# Altium schematic sheet control2.SchDoc
size A4
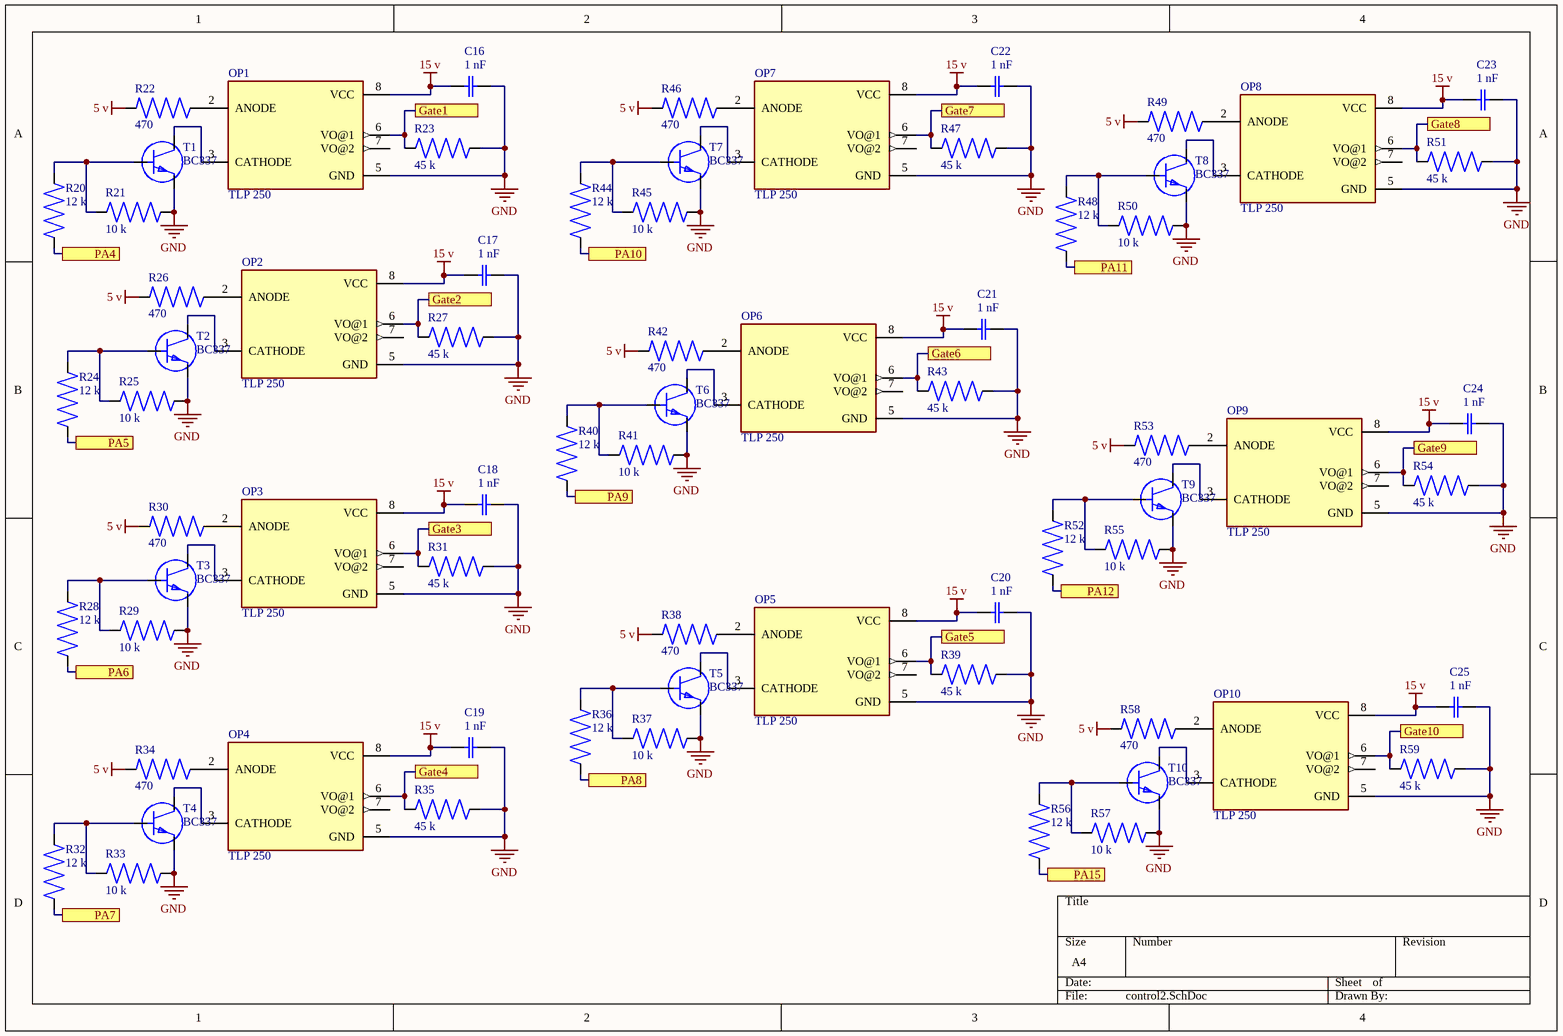
[diagram p0: control2.SchDoc]

## Parts
C16  1 nF  [0805-c]
C17  1 nF  [0805-c]
C18  1 nF  [0805-c]
C19  1 nF  [0805-c]
C20  1 nF  [0805-c]
C21  1 nF  [0805-c]
C22  1 nF  [0805-c]
C23  1 nF  [0805-c]
C24  1 nF  [0805-c]
C25  1 nF  [0805-c]
OP1  TLP 250  [TLP 250]
OP2  TLP 250  [TLP 250]
OP3  TLP 250  [TLP 250]
OP4  TLP 250  [TLP 250]
OP5  TLP 250  [TLP 250]
OP6  TLP 250  [TLP 250]
OP7  TLP 250  [TLP 250]
OP8  TLP 250  [TLP 250]
OP9  TLP 250  [TLP 250]
OP10  TLP 250  [TLP 250]
R20  12 k  [10 k]
R21  10 k  [10 k]
R22  470  [10 k]
R23  45 k  [10 k]
R24  12 k  [10 k]
R25  10 k  [10 k]
R26  470  [10 k]
R27  45 k  [10 k]
R28  12 k  [10 k]
R29  10 k  [10 k]
R30  470  [10 k]
R31  45 k  [10 k]
R32  12 k  [10 k]
R33  10 k  [10 k]
R34  470  [10 k]
R35  45 k  [10 k]
R36  12 k  [10 k]
R37  10 k  [10 k]
R38  470  [10 k]
R39  45 k  [10 k]
R40  12 k  [10 k]
R41  10 k  [10 k]
R42  470  [10 k]
R43  45 k  [10 k]
R44  12 k  [10 k]
R45  10 k  [10 k]
R46  470  [10 k]
R47  45 k  [10 k]
R48  12 k  [10 k]
R49  470  [10 k]
R50  10 k  [10 k]
R51  45 k  [10 k]
R52  12 k  [10 k]
R53  470  [10 k]
R54  45 k  [10 k]
R55  10 k  [10 k]
R56  12 k  [10 k]
R57  10 k  [10 k]
R58  470  [10 k]
R59  45 k  [10 k]
T1  BC337  [BC337]
T2  BC337  [BC337]
T3  BC337  [BC337]
T4  BC337  [BC337]
T5  BC337  [BC337]
T6  BC337  [BC337]
T7  BC337  [BC337]
T8  BC337  [BC337]
T9  BC337  [BC337]
T10  BC337  [BC337]

## Ports
Gate1, Gate2, Gate3, Gate4, Gate5, Gate6, Gate7, Gate8, Gate9, Gate10, PA4, PA5, PA6, PA7, PA8, PA9, PA10, PA11, PA12, PA15

## Nets
5 v: R22.1 R26.1 R30.1 R34.1 R38.1 R42.1 R46.1 R49.1 R53.1 R58.1
15 v: C16.1(C1) C17.1(C1) C18.1(C1) C19.1(C1) C20.1(C1) C21.1(C1) C22.1(C1) C23.1(C1) C24.1(C1) C25.1(C1) OP1.8(VCC) OP2.8(VCC) OP3.8(VCC) OP4.8(VCC) OP5.8(VCC) OP6.8(VCC) OP7.8(VCC) OP8.8(VCC) OP9.8(VCC) OP10.8(VCC)
GND: C16.2(C2) C17.2(C2) C18.2(C2) C19.2(C2) C20.2(C2) C21.2(C2) C22.2(C2) C23.2(C2) C24.2(C2) C25.2(C2) OP1.5(GND) OP2.5(GND) OP3.5(GND) OP4.5(GND) OP5.5(GND) OP6.5(GND) OP7.5(GND) OP8.5(GND) OP9.5(GND) OP10.5(GND) R21.1 R23.1 R25.1 R27.1 R29.1 R31.1 R33.1 R35.1 R37.1 R39.1 R41.1 R43.1 R45.1 R47.1 R50.1 R51.1 R54.1 R55.1 R57.1 R59.1 T1.1(E) T2.1(E) T3.1(E) T4.1(E) T5.1(E) T6.1(E) T7.1(E) T8.1(E) T9.1(E) T10.1(E)
Gate1: OP1.6(VO@1) R23.2 ; port Gate1
Gate2: OP2.6(VO@1) R27.2 ; port Gate2
Gate3: OP3.6(VO@1) R31.2 ; port Gate3
Gate4: OP4.6(VO@1) R35.2 ; port Gate4
Gate5: OP5.6(VO@1) R39.2 ; port Gate5
Gate6: OP6.6(VO@1) R43.2 ; port Gate6
Gate7: OP7.6(VO@1) R47.2 ; port Gate7
Gate8: OP8.6(VO@1) R51.2 ; port Gate8
Gate9: OP9.6(VO@1) R54.2 ; port Gate9
Gate10: OP10.6(VO@1) R59.2 ; port Gate10
PA4: R20.2 ; port PA4
PA5: R24.2 ; port PA5
PA6: R28.2 ; port PA6
PA7: R32.2 ; port PA7
PA8: R36.2 ; port PA8
PA9: R40.2 ; port PA9
PA10: R44.2 ; port PA10
PA11: R48.2 ; port PA11
PA12: R52.2 ; port PA12
PA15: R56.2 ; port PA15
NetOP1_2: OP1.2(ANODE) R22.2
NetOP1_3: OP1.3(CATHODE) T1.3(C)
NetOP2_2: OP2.2(ANODE) R26.2
NetOP2_3: OP2.3(CATHODE) T2.3(C)
NetOP3_2: OP3.2(ANODE) R30.2
NetOP3_3: OP3.3(CATHODE) T3.3(C)
NetOP4_2: OP4.2(ANODE) R34.2
NetOP4_3: OP4.3(CATHODE) T4.3(C)
NetOP5_2: OP5.2(ANODE) R38.2
NetOP5_3: OP5.3(CATHODE) T5.3(C)
NetOP6_2: OP6.2(ANODE) R42.2
NetOP6_3: OP6.3(CATHODE) T6.3(C)
NetOP7_2: OP7.2(ANODE) R46.2
NetOP7_3: OP7.3(CATHODE) T7.3(C)
NetOP8_2: OP8.2(ANODE) R49.2
NetOP8_3: OP8.3(CATHODE) T8.3(C)
NetOP9_2: OP9.2(ANODE) R53.2
NetOP9_3: OP9.3(CATHODE) T9.3(C)
NetOP10_2: OP10.2(ANODE) R58.2
NetOP10_3: OP10.3(CATHODE) T10.3(C)
NetR20_1: R20.1 R21.2 T1.2(B)
NetR24_1: R24.1 R25.2 T2.2(B)
NetR28_1: R28.1 R29.2 T3.2(B)
NetR32_1: R32.1 R33.2 T4.2(B)
NetR36_1: R36.1 R37.2 T5.2(B)
NetR40_1: R40.1 R41.2 T6.2(B)
NetR44_1: R44.1 R45.2 T7.2(B)
NetR48_1: R48.1 R50.2 T8.2(B)
NetR52_1: R52.1 R55.2 T9.2(B)
NetR56_1: R56.1 R57.2 T10.2(B)

Not connected (* = marked no-connect by the designer): OP1 7(VO@2); OP2 7(VO@2); OP3 7(VO@2); OP4 7(VO@2); OP5 7(VO@2); OP6 7(VO@2); OP7 7(VO@2); OP8 7(VO@2); OP9 7(VO@2); OP10 7(VO@2)

## Library data of the parts
C16-C25 = 0805-C
R20 R22-R24 R26-R28 R30-R32 R34-R36 R38-R40 R42-R44 R46-R49 R51-R54 R56 R58 R59 = 10 k